# EAGLE design OxFloodNet_sensor (EAGLE 6.5.0)
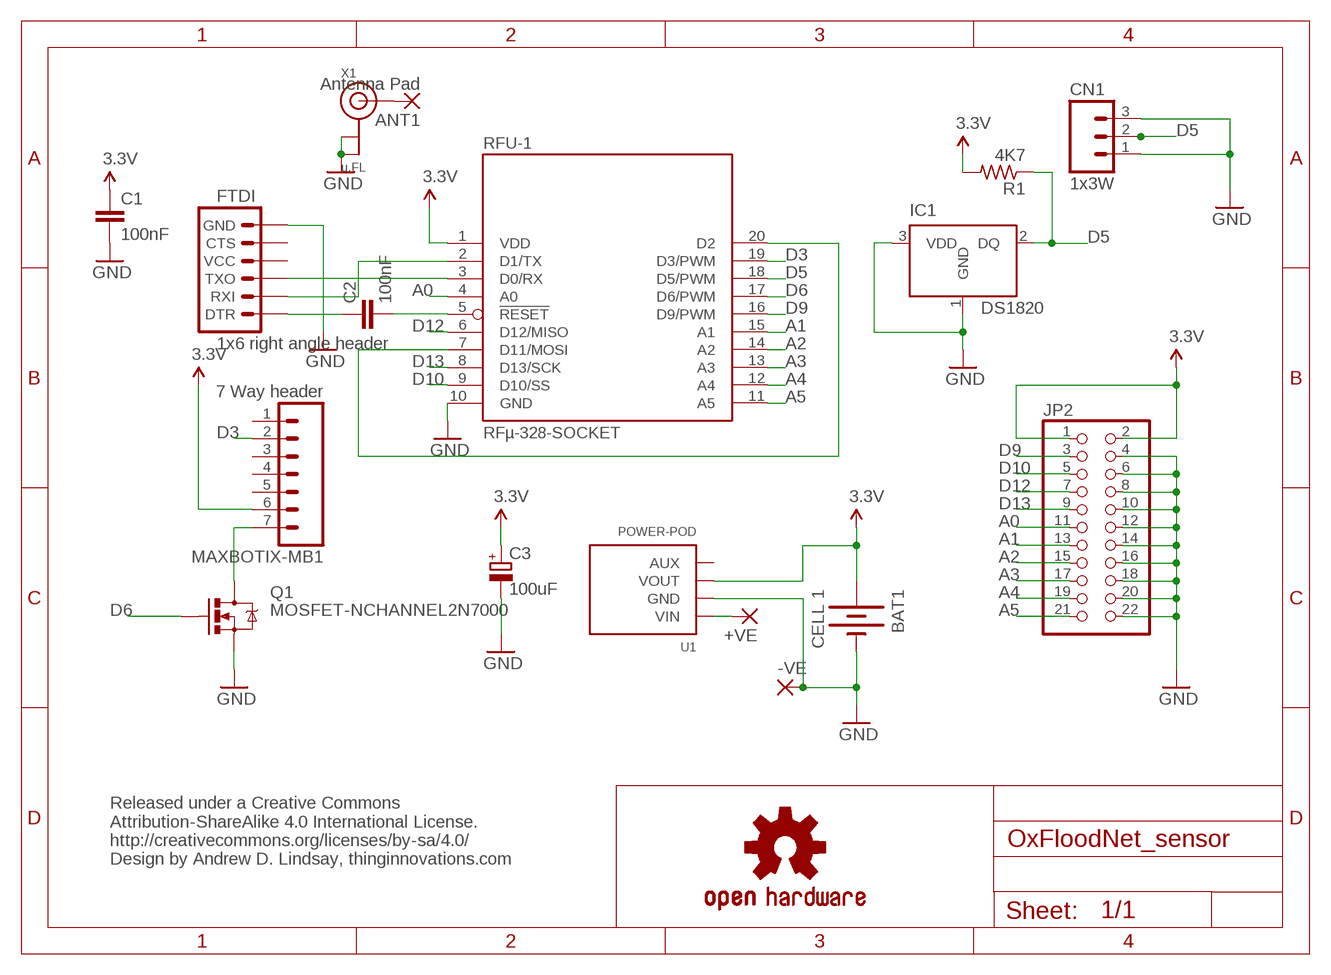
[diagram p0: schematic, sheet 1]

## Parts
+VE  2,54/0,8  [2,54/0,8]
-VE  2,54/0,8  [2,54/0,8]
ANT1  Antenna Pad  2,54/0,8  [2,54/0,8]
BAT1  CELL 1  BATTERYAA  [BATTERY-AA]
C1  100nF  C-EU025-024X044  [C025-024X044]
C2  100nF  C-EU025-024X044  [C025-024X044]
C3  100uF  CPOL-EUE2,5-6E  [E2,5-6E]
CN1  1x3W  M03PTH  [1X03]
FTDI  1x6 right angle header  ARDUINO_SERIAL_PROGRAMLONGPADS  [1X06_LONGPADS]
IC1  DS1820  [TO-92]
JP2  PINHD-2X11  [2X11]
LOGO1  OSHW-LOGOM  [OSHW-LOGO-M]
MAXBOTIX-MB1  7 Way header  M07LONGPADS  [1X07_LONGPADS]
Q1  MOSFET-NCHANNEL2N7000  [TO-92]
R1  4K7  R-US_0207/7  [0207/7]
RFU-1  RFµ-328-SOCKET  [RFµ-328-SOCKET]
U1  POWER-POD  [POWER-POD-LANDING]
X1  u.FL  ANTENNA_U.FL  [U.FL]

## Nets
3.3V [3.3V]: BAT1.PWR@1(+) C1.1 C3.+ JP2.1 JP2.2 MAXBOTIX-MB1.6 R1.2 RFU-1.1(VDD) U1.3(VOUT)
A0: JP2.11 RFU-1.4(A0)
A1: JP2.13 RFU-1.15(A1)
A2: JP2.15 RFU-1.14(A2)
A3: JP2.17 RFU-1.13(A3)
A4: JP2.19 RFU-1.12(A4)
A5: JP2.21 RFU-1.11(A5)
D3: MAXBOTIX-MB1.2 RFU-1.19(D3/PWM)
D5: CN1.2 IC1.2(DQ) R1.1 RFU-1.18(D5/PWM)
D6: Q1.2(G) RFU-1.17(D6/PWM)
D9: JP2.3 RFU-1.16(D9/PWM)
D10: JP2.5 RFU-1.9(D10/SS)
D12: JP2.7 RFU-1.6(D12/MISO)
D13: JP2.9 RFU-1.8(D13/SCK)
GND: -VE.1(P) BAT1.GND@1(-) C1.2 C3.- CN1.1 CN1.3 FTDI.6(GND) IC1.1(GND) IC1.3(VDD) JP2.4 JP2.6 JP2.8 JP2.10 JP2.12 JP2.14 JP2.16 JP2.18 JP2.20 JP2.22 Q1.1(S) RFU-1.10(GND) U1.2(GND) X1.1(GND) X1.2(GND)
N$1: RFU-1.7(D11/MOSI) RFU-1.20(D2)
N$2: MAXBOTIX-MB1.7 Q1.3(D)
N$3 [3.3V]: +VE.1(P) U1.1(VIN)
N$4: C2.2 RFU-1.5(!RESET)
N$5: C2.1 FTDI.1(DTR)
N$6: FTDI.2(RXI) RFU-1.2(D1/TX)
N$7: FTDI.3(TXO) RFU-1.3(D0/RX)
N$9: ANT1.1(P) X1.3(SIGNAL)
Unconnected: FTDI.4(VCC) FTDI.5(CTS) MAXBOTIX-MB1.1 MAXBOTIX-MB1.3 MAXBOTIX-MB1.4 MAXBOTIX-MB1.5 U1.4(AUX)

## Notes on the sheet
- Released under a Creative Commons
  Attribution-ShareAlike 4.0 International License.
  http://creativecommons.org/licenses/by-sa/4.0/
  Design by Andrew D. Lindsay, thinginnovations.com

## Library data of the parts
+VE -VE ANT1 = wirepad:2,54/0,8: THROUGH-HOLE PAD
BAT1 = SparkFun-Electromechanical:BATTERY: Battery Holders Various common sizes : AA, AAA, 20mm coin cell and 12mm coin cell. 20MM_4LEGS, BATT-10373
C1 C2 = rcl:C-EU: CAPACITOR, European symbol
C3 = rcl:CPOL-EU: POLARIZED CAPACITOR, European symbol
CN1 = SparkFun-Connectors:M03: Header 3 Standard 3-pin 0.1" header. Use with straight break away headers (SKU : PRT-00116), right angle break away headers (PRT-00553), swiss pins (PRT-00743), machine pins (PRT-00117), and female headers (PRT-00115). Molex polarized connector foot print use with SKU : PRT-08232 with associated crimp pins and housings.
FTDI = SparkFun-Connectors:ARDUINO_SERIAL_PROGRAM: FTDI connector footprints
IC1 = DS1820:DS1820: DS1820 - 1-Wire Digital Thermometer
JP2 = pinhead:PINHD-2X11: PIN HEADER
LOGO1 = SparkFun-Aesthetics:OSHW-LOGO: Open Source Hardware Logo This logo indicates the piece of hardware it is found on incorporates a OSHW license and/or adheres to the definition of open source hardware found here: http://freedomdefined.org/OSHW
MAXBOTIX-MB1 = SparkFun-Connectors:M07: Header 7 Standard 7-pin 0.1" header. Use with straight break away headers (SKU : PRT-00116), right angle break away headers (PRT-00553), swiss pins (PRT-00743), machine pins (PRT-00117), and female headers (PRT-00115). NOTES ON THE VARIANTS LOCK and LOCK_LONGPADS... This footprint was designed to help hold the alignment of a through-hole component (i.e. 7-pin header) while soldering it into place. You may notice that each hole has been shifted either up or down by 0.005 of an inch from it's more standard position (which is usually a perfectly straight line). This slight alteration caused the pins (the squares in the middle) to touch the edges of the holes. Because they are alternating, it causes a "brace" to hold the header in place. 0.005 has proven to be the perfect amount of "off-center" position when using our standard breakaway headers. Although looks a little odd when you look at the bare footprint, once you have a header in there, the alteration is very hard to notice. Also, if you push a header all the way into place, it is covered up entirely on the bottom side. This idea of altering the position of holes to aid alignment will be further integrated into the Sparkfun Library for other footprints. It can help hold any component with 3 or more connection pins.
Q1 = SparkFun-DiscreteSemi:MOSFET-NCHANNEL: Common NMOSFET Parts MFG P/N Store ID Prod ID FDD8780 TRANS-09984 SI7820DN TRANS-11055 FDS6630A IC-08089 2N7002PW TRANS-11151 FQP30N06L COM-10213 TRANS-10060 BSS123LT1G TRANS-08345 BSS138 TRANS-00830 BS170 2N7000
R1 = adafruit:R-US_: RESISTOR, American symbol
RFU-1 = Ciseco Footprints:RFµ-328
U1 = Ciseco Footprints:POWER-POD
X1 = adafruit:ANTENNA_U.FL: U.FL Antenna Connector

## Net classes
0 default: width 0.2 mm, clearance 0.205 mm
1 3.3V: width 0.4 mm, clearance 0.25 mm

## Board
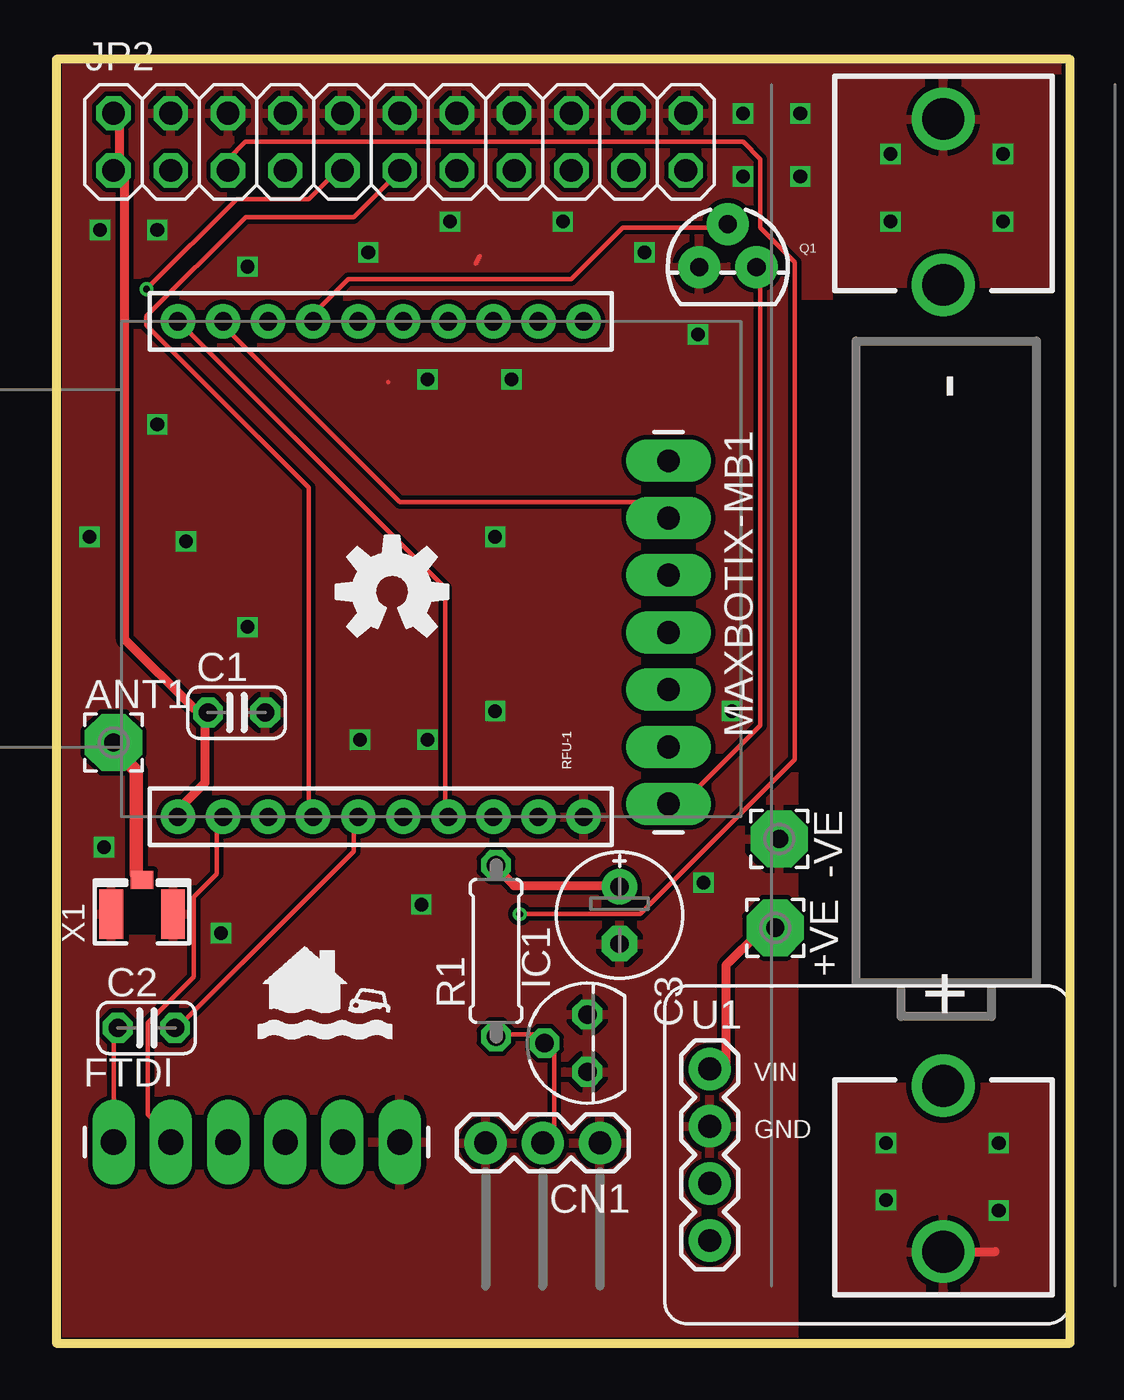
[diagram p1: board, top side]
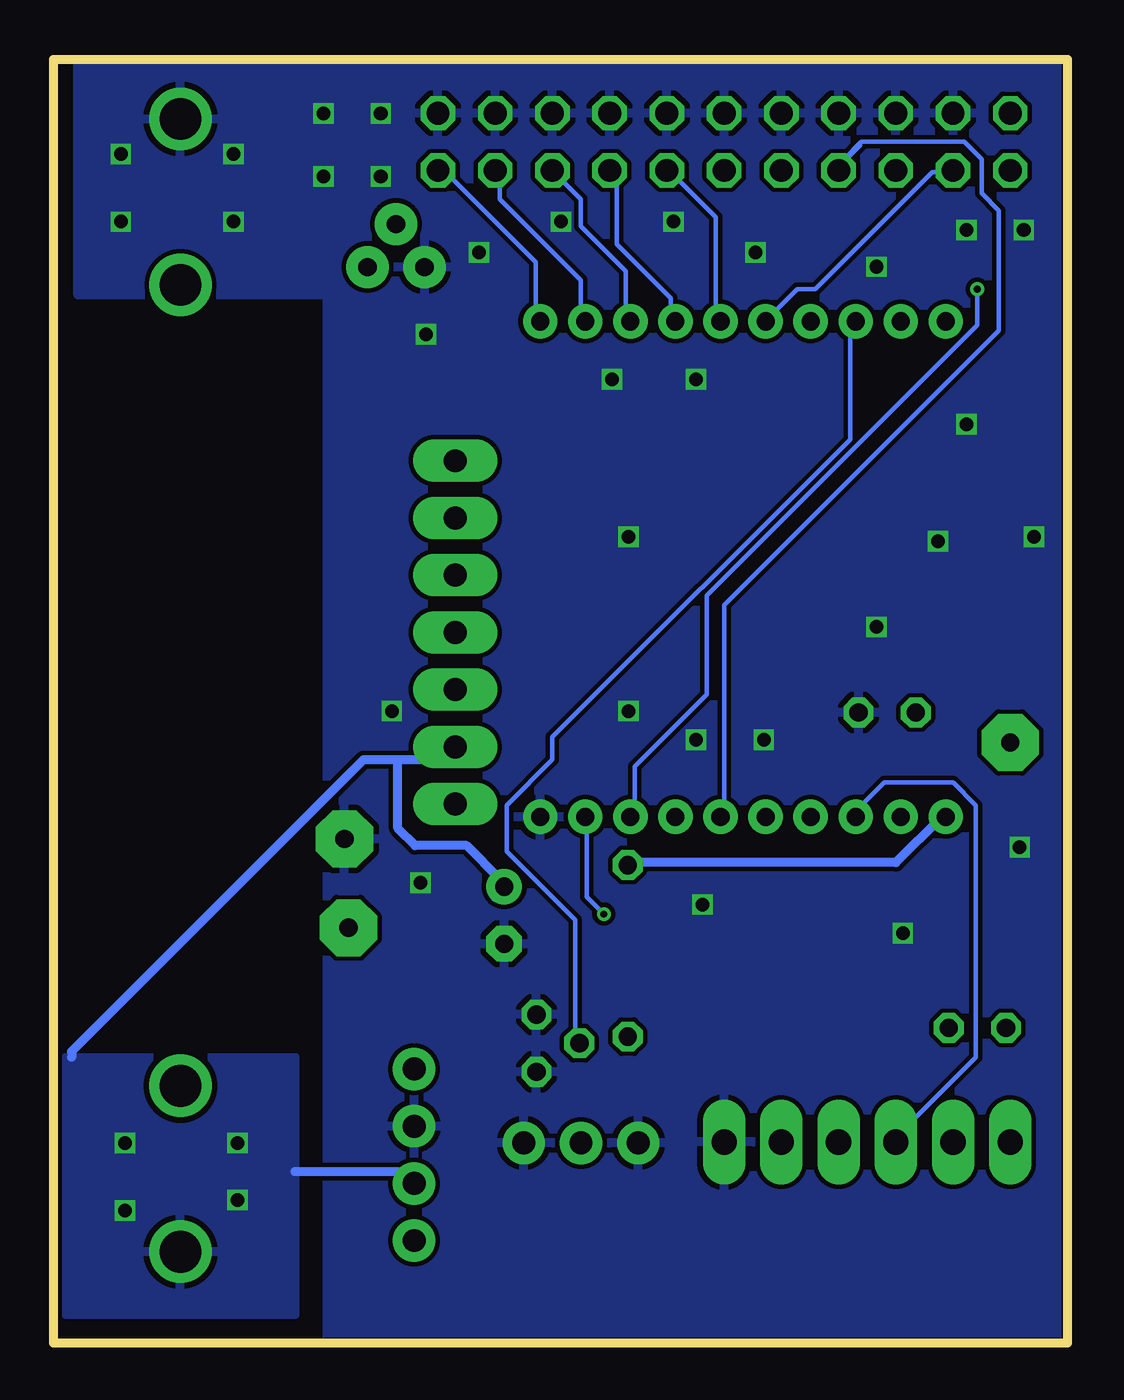
[diagram p2: board, bottom side, seen from below]

Size 44.88 x 57.14 mm. Coordinates in mm from the lower left corner, seen from the top.
Outline: 0,0 44.88,0 44.88,57.14 0,57.14 0,0
Copper layers (1*16): Top 0.035mm / dielectric 1.5mm / Bottom 0.035mm
Design rules "dirt_cheap_dirty_boards.v1": minimum track width 5mil, minimum drill 12mil, track to track 5mil, track to pad 5mil, pad to pad 5mil, via to via 5mil, smd to smd 0mil, copper to edge 10mil, drill to drill 10mil, minimum pad ring 10mil, minimum via ring 6mil, stop-mask expansion 2mil, vias tented up to drill 25mil, thermal gap 10mil
Milling: 4 lines

### Footprints (pad centres in the part's own frame; a part is rotated, then mirrored left to right if it is on the bottom)
2,54/0,8 = drill 0.813 pad 2.54 octagon: 1 0,0
BATTERY-AA = drill 1.854: GND@1 25.146,0; GND@2 17.78,0; PWR@1 -25.146,0; PWR@2 -17.78,0
C025-024X044 = drill 0.813 octagon: 1 -1.27,0; 2 1.27,0
E2,5-6E = drill 0.813 pad 1.575: + -1.27,0 | drill 0.813 pad 1.575 octagon: - 1.27,0
1X03 = drill 1.016 pad 1.88: 1 0,0; 2 2.54,0; 3 5.08,0
1X06_LONGPADS = drill 1.118 pad 1.88 long: 1 0,0; 2 2.54,0; 3 5.08,0; 4 7.62,0; 5 10.16,0; 6 12.7,0
TO-92 = drill 0.813 pad 1.27 octagon: 1 -1.27,0; 2 0,1.905; 3 1.27,0
2X11 = drill 1.016 octagon: 1 -12.7,-1.27; 2 -12.7,1.27; 3 -10.16,-1.27; 4 -10.16,1.27; 5 -7.62,-1.27; 6 -7.62,1.27; 7 -5.08,-1.27; 8 -5.08,1.27; 9 -2.54,-1.27; 10 -2.54,1.27; 11 0,-1.27; 12 0,1.27; 13 2.54,-1.27; 14 2.54,1.27; 15 5.08,-1.27; 16 5.08,1.27; 17 7.62,-1.27; 18 7.62,1.27; 19 10.16,-1.27; 20 10.16,1.27; 21 12.7,-1.27; 22 12.7,1.27
1X07_LONGPADS = drill 1.016 pad 1.88 long: 1 0,0; 2 2.54,0; 3 5.08,0; 4 7.62,0; 5 10.16,0; 6 12.7,0; 7 15.24,0
TO-92' = drill 0.813 pad 1.88: 1 -1.27,0; 2 0,1.905; 3 1.27,0
0207/7 = drill 0.813 octagon: 1 -3.81,0; 2 3.81,0
RFµ-328-SOCKET = drill 0.8 pad 1.524: 1 -11,20; 2 -11,18; 3 -11,16; 4 -11,14; 5 -11,12; 6 -11,10; 7 -11,8; 8 -11,6; 9 -11,4; 10 -11,2; 11 11,2; 12 11,4; 13 11,6; 14 11,8; 15 11,10; 16 11,12; 17 11,14; 18 11,16; 19 11,18; 20 11,20
POWER-POD-LANDING = drill 1.016 pad 1.88: 1 -3.81,0; 2 -1.27,0; 3 1.27,0; 4 3.81,0
U.FL = smd 2.2 x 1.05: 1 0,1.375; 2 0,-1.375 | smd 0.8 x 1: 3 1.525,0

### Placement (x,y rotation side)
+VE  31.91,18.45 270 top
-VE  32.09,22.39 270 top
ANT1  2.54,26.67 0 top
BAT1  39.37,29.21 90 top
C1  8,28 0 top
C2  4,14 0 top
C3  25,19 270 top
CN1  24.13,8.89 180 top
FTDI  2.54,8.93 0 top
IC1  23.57,13.32 90 top
JP2  15.24,53.34 0 top
LOGO1  14.9,33.36 0 top
MAXBOTIX-MB1  27.17,39.18 270 top
Q1  MOSFET-NCHANNEL2N7000  [TO-92']  29.8,47.78 0 top
R1  19.52,17.42 90 top
RFU-1  25.4,34.37 90 top
U1  29,8.37 270 top
X1  3.81,19.05 90 top

### Tracks (layer width: path | path; a pad name or v marks a point on that pad's centre or on a via)
3.3V  (via drill 0.6)
  Top 0.4: BAT1.PWR@1 41.66,4.06 | C3.+ 24.89,20.32 20.32,20.32 19.81,20.83 R1.2 | RFU-1.1 5.59,23.88 6.6,24.89 6.6,27.94 C1.1 6.1,28.19 3.05,31.24 3.05,51.82 JP2.1 2.8,52.4 2.8,54.4 JP2.2
  Bottom 0.4: R1.2 19.3,21.34 7.62,21.34 5.59,23.37 RFU-1.1 | 25.4,19.81 C3.+ 25.15,20.57 26.67,22.1 28.96,22.1 29.72,22.86 29.72,25.91 | 34.29,7.62 29.72,7.62 U1.3 | 29.72,25.91 31.24,25.91 44.2,12.95 44.2,12.7 | 29.72,25.91 27.43,25.91 MAXBOTIX-MB1.6
  other vias: 36.83,6.35 36.83,8.89 41.83,8.89 41.83,5.89
  pour Bottom: 34.29,1.27 44.45,1.27 44.45,12.7 34.29,12.7
  pour Top: 34,13.5 34,1 45.23,1 45.23,13.5
A0
  Top 0.2: RFU-1.4 11.2,23.6 11.2,38 4,45.2 4,45.6 8.4,50 13.2,50 15.2,52 JP2.11
A1
  Bottom 0.2: RFU-1.15 15.6,45.6 15.6,50 17.6,52 JP2.13
A2
  Bottom 0.2: RFU-1.14 17.6,45.6 17.6,46.4 20,48.8 20,52 JP2.15
A3
  Bottom 0.2: RFU-1.13 19.6,45.6 19.6,47.6 21.6,49.6 21.6,50.8 22.8,52 JP2.17
A4
  Bottom 0.2: RFU-1.12 21.6,45.6 21.6,47.2 25.2,50.8 25.2,52 JP2.19
A5
  Bottom 0.2: RFU-1.11 23.6,45.6 23.6,48 27.6,52 JP2.21
D3
  Top 0.2: RFU-1.19 7.62,44.96 15.24,37.34 26.67,37.34 MAXBOTIX-MB1.2
D5
  Top 0.2: R1.1 19.81,13.72 21.34,13.72 IC1.2 22.1,12.95 22.1,9.14 CN1.2
  Bottom 0.2: RFU-1.18 9.65,45.21 9.65,40.13 22.86,26.92 22.86,25.91 24.89,23.88 24.89,21.84 21.84,18.8 21.84,13.72 IC1.2
D6
  Top 0.2: RFU-1.17 11.43,45.72 12.95,47.24 22.86,47.24 25.15,49.53 29.72,49.53 Q1.2
D9
  Bottom 0.2: JP2.3 5.2,52 6,52 11.2,46.8 12,46.8 13.2,45.6 RFU-1.16
D10  (via drill 0.3)
  Top 0.2: v20.57,19.05 25.91,19.05 32.77,25.91 32.77,48.01 31.24,49.53 31.24,52.58 30.48,53.34 8.38,53.34 7.62,52.58 JP2.5
  Bottom 0.2: v20.57,19.05 21.34,19.81 21.34,22.86 RFU-1.9
D12
  Bottom 0.2: 9.2,53.2 10,52.4 JP2.7 9.91,52.58 9.14,53.34 4.57,53.34 3.81,52.58 3.81,51.05 3.05,50.29 3.05,44.96 15.24,32.77 15.24,23.62 RFU-1.6
D13  (via drill 0.3)
  Top 0.2: v4,46.8 8,50.8 11.2,50.8 12.4,52 JP2.9
  Bottom 0.2: v4,46.8 4,45.2 16,33.2 16,28.8 19.2,25.6 19.2,23.6 RFU-1.8
GND  (via drill 0.6)
  Top 0.2: 18.8,48.26 18.62,47.94 | X1.2 5.08,19.3 5.24,19.3 | 14.73,42.67
  other vias: 30.48,54.61 30.48,51.8 33.02,54.61 33.02,51.8 4.48,49.44 2.12,22.02 16.2,19.48 13.85,48.44 17.48,49.8 8.48,47.8 16.48,26.8 22.48,49.8 26.11,48.44 37.02,52.8 37.02,49.8 42.02,49.8 42.02,52.8 8.48,31.8 13.48,26.8 16.48,42.8 28.48,44.8 19.48,28.07 19.48,35.8 5.75,35.61 1.48,35.8 4.48,40.8 20.21,42.8 28.72,20.45 29.99,28.07 1.94,49.44 7.31,18.21
  pour Top: -1.27,-2.54 32.75,-3 32.75,58.69 -0.77,58.69
  pour Bottom: -0.5,-1 32.87,-1 32.87,46.54 43.92,46.54 43.92,57.5 -0.5,57.5
  pour Top: 30.23,46.54 44.96,46.54 44.96,57 30.23,57
N$1
  Top 0.2: RFU-1.7 17.27,23.88 17.27,33.53 5.59,45.21 RFU-1.20
N$2
  Top 0.2: MAXBOTIX-MB1.7 27.43,24.38 28.19,24.38 31.24,27.43 31.24,47.24 Q1.3
N$3
  Top 0.4: U1.1 29.72,12.19 29.72,16.76 31.24,18.29 +VE.1
N$4
  Top 0.2: C2.2 5.59,14.22 13.21,21.84 13.21,23.37 RFU-1.5
N$5
  Top 0.2: FTDI.1 2.54,13.72 C2.1
N$6
  Top 0.2: RFU-1.2 7.11,23.37 7.11,20.83 6.1,19.81 6.1,16.26 4.06,14.22 4.06,10.16 5.08,9.14 FTDI.2
N$7
  Bottom 0.2: RFU-1.3 9.14,23.88 8.13,24.89 5.08,24.89 4.06,23.88 4.06,12.7 7.62,9.14 FTDI.3
N$9
  Top 0.2: 3.56,20.83 X1.3 | 2.54,26.42 ANT1.1
  Top 0.61: 3.56,20.83 3.56,25.4 2.54,26.42

### Text on the board
tDocu: GND | JP2 | PWR D9 D10 D12 D13 A0 A1 A2 A3 A4 A5 | - | Ciseco / RFu-328 | GND | Oxford | For Tadiran 3.6V Battery / Observe correct polarity | Flood Network | FTDI | + | No Power | GND | Temp Sensor
bDocu: GND | Oxford Flood Network Sensor V3.1 / oxfloodnet.co.uk / Design: Andrew D. Lindsay / thinginnovations.com / Released under a Creative Commons / Attribution-ShareAlike 4.0 International License. / http://creativecommons.org/licenses/by-sa/4.0/